# Altium schematic sheet micro.SchDoc: Arduino_Microcontroller
size A4; DocumentNumber: 2; SheetNumber: 2; SheetTotal: 3
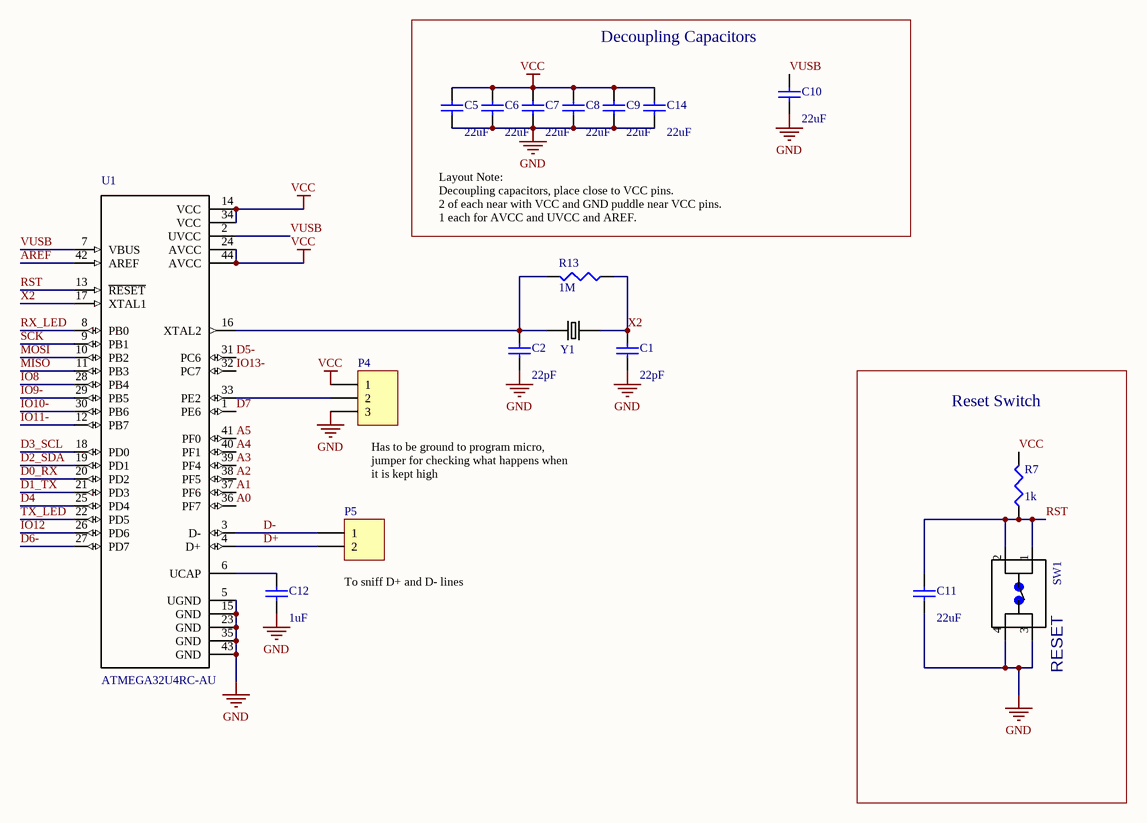
[diagram p0: micro.SchDoc]

## Parts
C1  value 22pF  [C1206]  (hidden comment: Cap Semi)
C2  value 22pF  [C1206]  (hidden comment: Cap Semi)
C5  value 22uF  [C1206]  (hidden comment: Cap Semi)
C6  value 22uF  [C1206]  (hidden comment: Cap Semi)
C7  value 22uF  [C1206]  (hidden comment: Cap Semi)
C8  value 22uF  [C1206]  (hidden comment: Cap Semi)
C9  value 22uF  [C1206]  (hidden comment: Cap Semi)
C10  value 22uF  [C1206]  (hidden comment: Cap Semi)
C11  value 22uF  [C1206]  (hidden comment: Cap Semi)
C12  value 1uF  [C1206]  (hidden comment: Cap Semi)
C14  value 22uF  [C1206]  (hidden comment: Cap Semi)
P4  +HWB-  [HDR1X3]  (value not drawn)
P5  +USB_D-  [HDR1X2]  (value not drawn)
R7  value 1k  [C1206]  (hidden comment: Res3)
R13  value 1M  [C1206]  (hidden comment: Res3)
SW1  RESET  [*TE_FSM4JSMA]
U1  ATMEGA32U4RC-AU  [*QFP80P1200X1200X120-44N]
Y1  ECS-35-17-5PX-TR  [*XTAL_ECS-35-17-5PX-TR]  (value not drawn)

## Blocks framed on the sheet
Decoupling Capacitors: C5-C10 C14
Reset Switch: C11 R7 SW1

## Nets
GND: C1.1 C2.1 C5.1 C6.1 C7.1 C8.1 C9.1 C10.1 C11.1 C12.1 C14.1 P4.3 SW1.3 SW1.4 U1.5(UGND) U1.15(GND) U1.23(GND) U1.35(GND) U1.43(GND)
VCC: C5.2 C6.2 C7.2 C8.2 C9.2 C14.2 P4.1 R7.2 U1.14(VCC) U1.24(AVCC) U1.34(VCC) U1.44(AVCC)
A0: U1.36(PF7)
A1: U1.37(PF6)
A2: U1.38(PF5)
A3: U1.39(PF4)
A4: U1.40(PF1)
A5: U1.41(PF0)
AREF: U1.42(AREF)
D0_RX: U1.20(PD2)
D1_TX: U1.21(PD3)
D2_SDA: U1.19(PD1)
D3_SCL: U1.18(PD0)
D4: U1.25(PD4)
D5-: U1.31(PC6)
D6-: U1.27(PD7)
D7: U1.1(PE6)
D+: P5.2 U1.4(D+)
D-: P5.1 U1.3(D-)
IO8: U1.28(PB4)
IO9-: U1.29(PB5)
IO10-: U1.30(PB6)
IO11-: U1.12(PB7)
IO12: U1.26(PD6)
IO13-: U1.32(PC7)
MISO: U1.11(PB3)
MOSI: U1.10(PB2)
RST: C11.2 R7.1 SW1.1 SW1.2 U1.13(~{RESET})
RX_LED: U1.8(PB0)
SCK: U1.9(PB1)
TX_LED: U1.22(PD5)
VUSB: C10.2 U1.2(UVCC) U1.7(VBUS)
X2: C1.2 R13.1 U1.17(XTAL1) Y1.2
NetC2_2: C2.2 R13.2 U1.16(XTAL2) Y1.1
NetC12_2: C12.2 U1.6(UCAP)
NetP4_2: P4.2 U1.33(PE2)

## Notes on the sheet
- Layout Note:
  Decoupling capacitors, place close to VCC pins.
  2 of each near with VCC and GND puddle near VCC pins.
  1 each for AVCC and UVCC and AREF.
- (near P4) Has to be ground to program micro,
  jumper for checking what happens when
  it is kept high
- (near P5) To sniff D+ and D- lines
- Title
- Size:
- Date:
- A4
- Number:
- Time:
- Revision:
- Sheet
- of
- File:

## Library data of the parts
C1 C2 C5-C12 C14 = Cap Semi: Capacitor (Semiconductor SIM Model); Published: 8-Jun-2000; LatestRevisionDate: 29-May-2009; LatestRevisionNote: IPC-7351 Footprint Added.; PackageReference: C1206; Publisher: Altium Limited; PackageDescription: Chip Capacitor
  C1 C2: DigiKeyPartNo: 732-7867-1-ND
  C5-C10 C14: DigiKeyPartNo: 1276-3300-1-ND
P4 = Header 3: Header, 3-Pin; LatestRevisionDate: 17-Jul-2002; LatestRevisionNote: Re-released for DXP Platform.; Publisher: Altium Limited
P5 = Header 2: Header, 2-Pin; LatestRevisionDate: 17-Jul-2002; LatestRevisionNote: Re-released for DXP Platform.; Publisher: Altium Limited
R7 R13 = Res3: Resistor; Published: 8-Jun-2000; LatestRevisionDate: 29-May-2009; LatestRevisionNote: IPC-7351 Footprint Added.; PackageReference: 1206; Publisher: Altium Limited; PackageDescription: Chip Resistor
SW1 = FSM4JSMA: FSM4JSMA=SMT,TACTILE,PB SWITCH; MF: TE Connectivity; Package: None; EU_RoHS_Compliance: Compliant; TE_purchase_URL: https://www.te.com/usa-en/product-4-1437565-1.html?te_bu=Cor&te_type=disp&te_campaign=seda_glo_cor-seda-global-disp-prtnr-fy19-seda-model-bom-cta_sma-317_1&elqCampaignId=32493; MP: FSM4JSMA; Price: None; SnapEDA_Link: https://www.snapeda.com/parts/FSM4JSMA/TE%20Connectivity%20ALCOSWITCH%20Switches/view-part/?ref=snap; Availability: Unavailable; Value: *
U1 = ATMEGA32U4-AU: MCU 8-bit ATmega AVR RISC 32KB Flash 3.3V/5V 44-Pin TQFP; MF: Microchip; Availability: Unavailable; MP: ATMEGA32U4-AU; SnapEDA_Link: https://www.snapeda.com/parts/ATMEGA32U4-AU/Microchip/view-part/?ref=snap; Price: None; Package: TQFP-44 Microchip; Value: *; ComponentLink1URL: https://www.digikey.com/products/en?keywords=ATMEGA32U4RC-AU-ND; ComponentLink1Description: Documentation
Y1 = ECS-35-17-5PX-TR: Crystal 3.579545MHz Â±30ppm _Tol_ Â±50ppm _Stability_ 17pF FUND 150Ohm 2-Pin HC-49/USX SMD T/R; MF: ECS Inc.; Package: HC49/US ECS International; Price: None; Availability: Unavailable; MP: ECS-35-17-5PX-TR; SnapEDA_Link: https://www.snapeda.com/parts/ECS-35-17-5PX-TR/ECS%20Inc./view-part/?ref=snap; Value: *